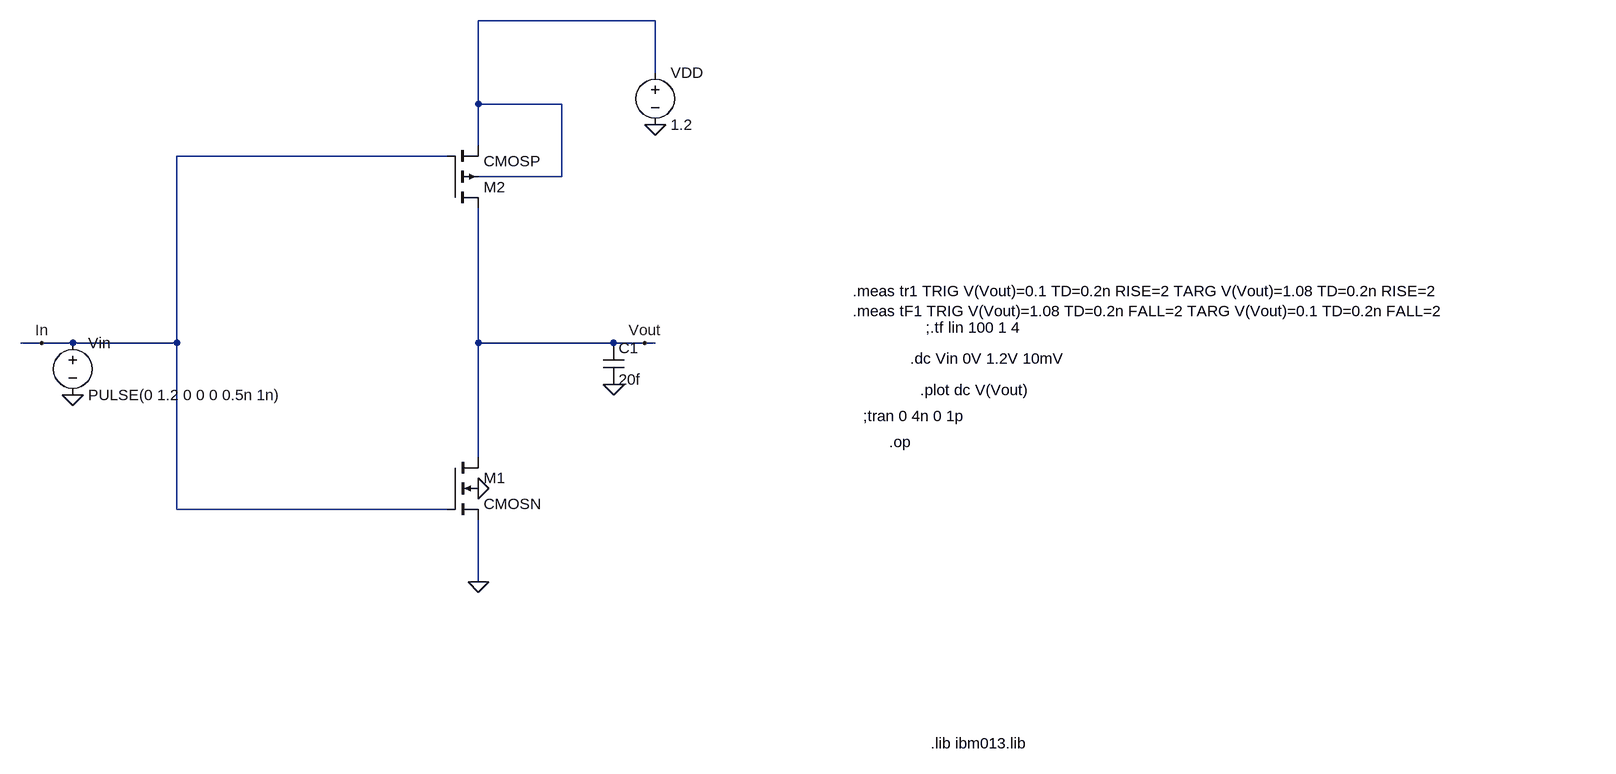
[diagram p0: schematic cmosinv.asc]
cmosinv.asc, the LTspice schematic file:
Version 4
SHEET 1 1504 680
WIRE -16 -1024 -288 -1024
WIRE -16 -944 -16 -1024
WIRE -288 -896 -288 -1024
WIRE -160 -896 -288 -896
WIRE -288 -832 -288 -896
WIRE -336 -816 -752 -816
WIRE -160 -784 -160 -896
WIRE -160 -784 -288 -784
WIRE -960 -528 -992 -528
WIRE -912 -528 -960 -528
WIRE -752 -528 -752 -816
WIRE -752 -528 -912 -528
WIRE -288 -528 -288 -736
WIRE -80 -528 -288 -528
WIRE -32 -528 -80 -528
WIRE -16 -528 -32 -528
WIRE -288 -352 -288 -528
WIRE -752 -272 -752 -528
WIRE -336 -272 -752 -272
WIRE -288 -160 -288 -256
FLAG -288 -160 0
FLAG -16 -864 0
FLAG -288 -304 0
FLAG -960 -528 In
FLAG -32 -528 Vout
FLAG -912 -448 0
FLAG -80 -464 0
SYMBOL nmos4 -336 -352 R0
SYMATTR InstName M1
SYMATTR Value CMOSN
SYMATTR Value2 l=120n w=2.936u
SYMBOL pmos4 -336 -736 M180
SYMATTR InstName M2
SYMATTR Value CMOSP
SYMATTR Value2 l=120n w=7u
SYMBOL voltage -16 -960 R0
WINDOW 123 0 0 Left 0
WINDOW 39 0 0 Left 0
SYMATTR InstName VDD
SYMATTR Value 1.2
SYMBOL cap -96 -528 R0
SYMATTR InstName C1
SYMATTR Value 20f
SYMBOL voltage -912 -544 R0
WINDOW 123 0 0 Left 0
WINDOW 39 0 0 Left 0
SYMATTR InstName Vin
SYMATTR Value PULSE(0 1.2 0 0 0 0.5n 1n)
TEXT 408 88 Left 2 !.lib ibm013.lib
TEXT 344 -376 Left 2 !.op
TEXT 400 -552 Left 2 !;.tf lin 100 1 4
TEXT 304 -416 Left 2 !;tran 0 4n 0 1p
TEXT 376 -504 Left 2 !.dc Vin 0V 1.2V 10mV
TEXT 392 -456 Left 2 !.plot dc V(Vout)
TEXT 288 -608 Left 2 !.meas tr1 TRIG V(Vout)=0.1 TD=0.2n RISE=2 TARG V(Vout)=1.08 TD=0.2n RISE=2                                   \n.meas tF1 TRIG V(Vout)=1.08 TD=0.2n FALL=2 TARG V(Vout)=0.1 TD=0.2n FALL=2

The netlist it stands for:
* cmosinv.asc
M1 Vout In 0 0 CMOSN l=120n w=2.936u
M2 Vout In N001 N001 CMOSP l=120n w=7u
VDD N001 0 1.2
C1 Vout 0 20f
Vin In 0 PULSE(0 1.2 0 0 0 0.5n 1n)
.model NMOS NMOS
.model PMOS PMOS
.lib standard.mos
.lib ibm013.lib
.op
;.tf lin 100 1 4
;tran 0 4n 0 1p
.dc Vin 0V 1.2V 10mV
.plot dc V(Vout)
.meas tr1 TRIG V(Vout)=0.1 TD=0.2n RISE=2 TARG V(Vout)=1.08 TD=0.2n RISE=2
.meas tF1 TRIG V(Vout)=1.08 TD=0.2n FALL=2 TARG V(Vout)=0.1 TD=0.2n FALL=2
.backanno
.end